# EAGLE design sw63_mk3_2 (EAGLE 9.6.2)
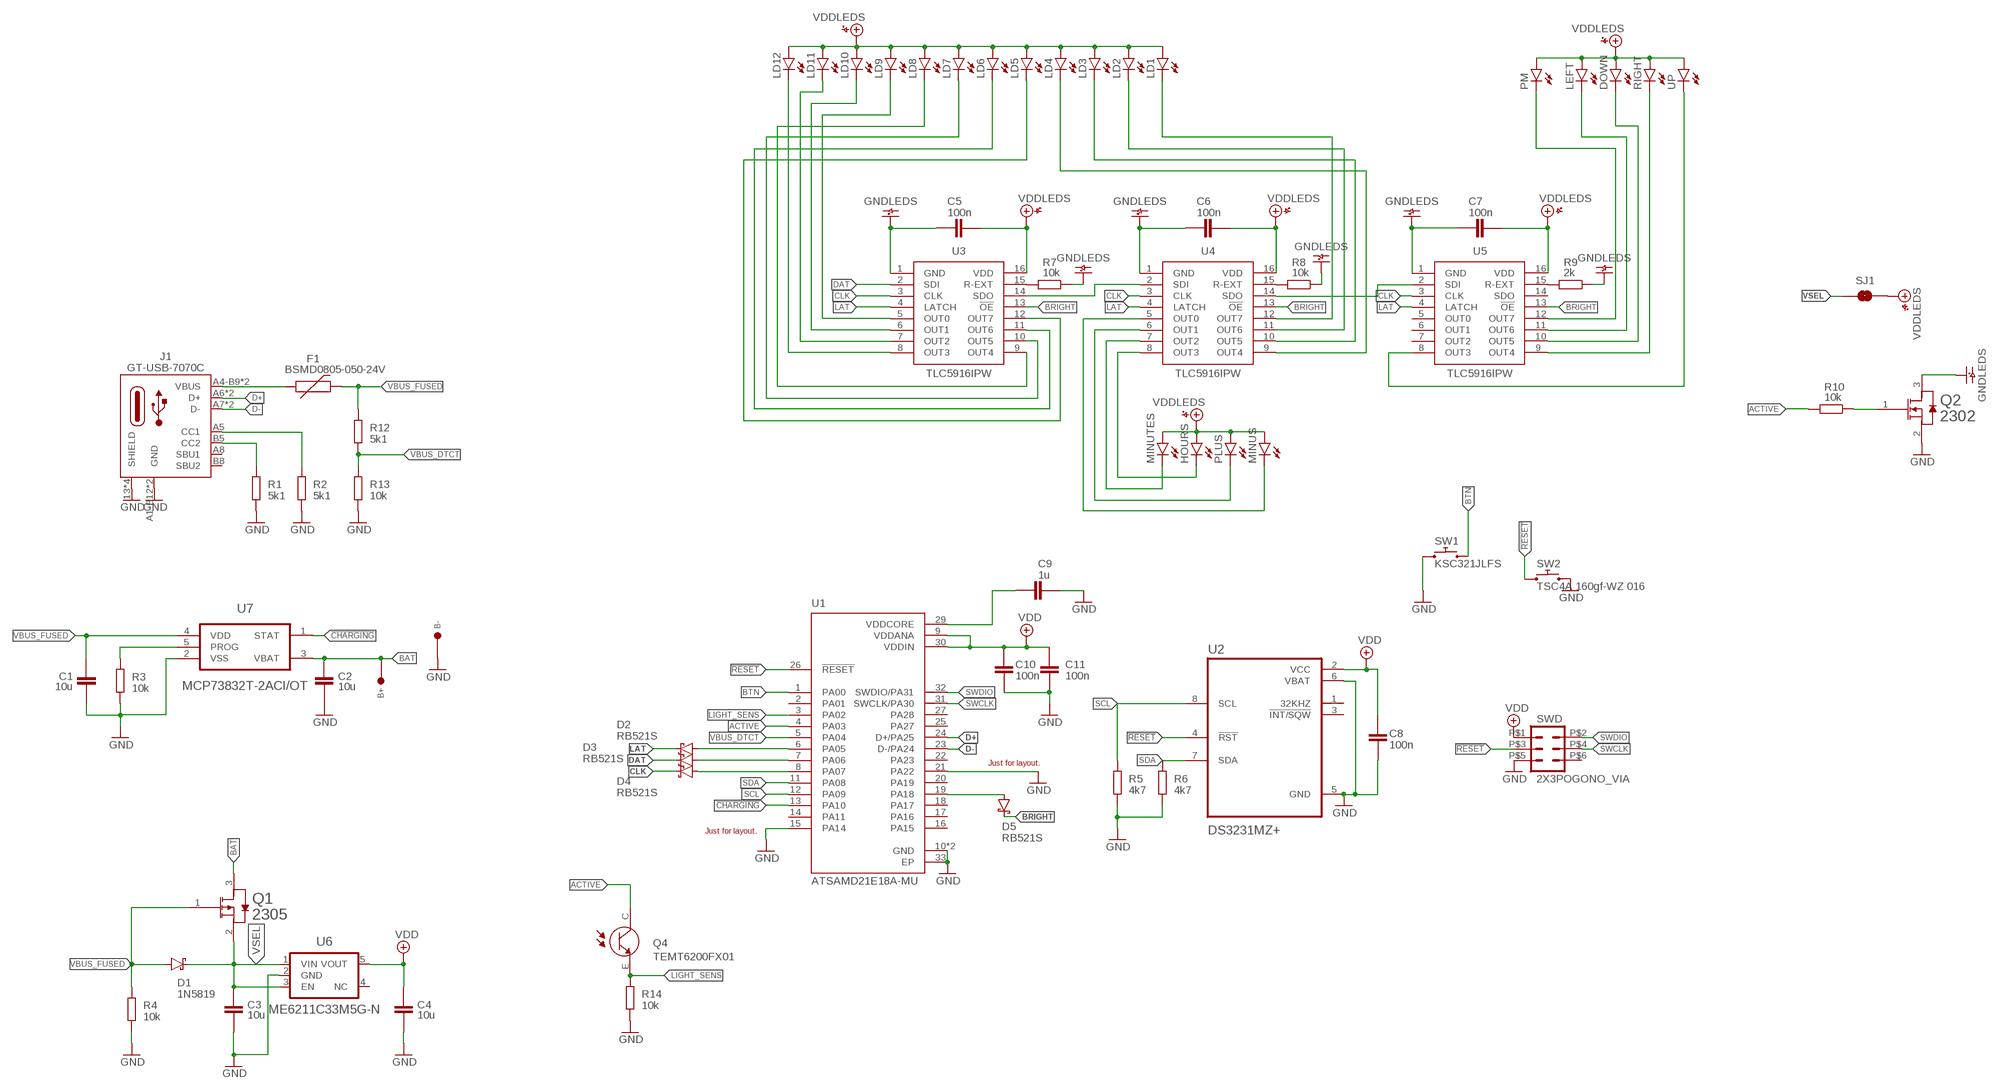
[diagram p0: schematic, sheet 1]

## Parts
B+  TEST_PIN_LARGE  [TEST_PIN_2.0]
B-  TEST_PIN_LARGE  [TEST_PIN_2.0]
C1  10u  CAPACITOR0805  [CAPACITOR0805]
C2  10u  CAPACITOR0805  [CAPACITOR0805]
C3  10u  CAPACITOR0805  [CAPACITOR0805]
C4  10u  CAPACITOR0805  [CAPACITOR0805]
C5  100n  CAPACITOR0603  [CAPACITOR0603]
C6  100n  CAPACITOR0603  [CAPACITOR0603]
C7  100n  CAPACITOR0603  [CAPACITOR0603]
C8  100n  CAPACITOR0603  [CAPACITOR0603]
C9  1u  CAPACITOR0603  [CAPACITOR0603]
C10  100n  CAPACITOR0603  [CAPACITOR0603]
C11  100n  CAPACITOR0603  [CAPACITOR0603]
D1  1N5819  SCHOTTKY_DIODE  [SOD123]
D2  RB521S  SCHOTTKY_DIODE_SOD523  [SOD523]
D3  RB521S  SCHOTTKY_DIODE_SOD523  [SOD523]
D4  RB521S  SCHOTTKY_DIODE_SOD523  [SOD523]
D5  RB521S  SCHOTTKY_DIODE_SOD523  [SOD523]
DOWN  LED_RECT-3.2X2  [LED_RECT_3.2X2]
F1  BSMD0805-050-24V  PTC  [PTC0805]
HOURS  LED_THT-5MM_B  [LED_5MM_BLUE]
J1  GT-USB-7070C  USB-C_2.0_SMT_WS  [USB-C_FULL_SMT_WS]
LD1  LED_SMT_1206  [LED_1206]
LD2  LED_SMT_1206  [LED_1206]
LD3  LED_SMT_1206  [LED_1206]
LD4  LED_SMT_1206  [LED_1206]
LD5  LED_SMT_1206  [LED_1206]
LD6  LED_SMT_1206  [LED_1206]
LD7  LED_SMT_1206  [LED_1206]
LD8  LED_SMT_1206  [LED_1206]
LD9  LED_SMT_1206  [LED_1206]
LD10  LED_SMT_1206  [LED_1206]
LD11  LED_SMT_1206  [LED_1206]
LD12  LED_SMT_1206  [LED_1206]
LEFT  LED_RECT-3.2X2  [LED_RECT_3.2X2]
MINUS  LED_THT-5MM_R  [LED_5MM_RED]
MINUTES  LED_THT-5MM_Y  [LED_5MM_YELLOW]
PLUS  LED_THT-5MM_G  [LED_5MM_GREEN]
PM  LED_THT-3MM_ALT  [LED_3MM_ALT]
Q1  2305  LGE2305  [SOT23]
Q2  2302  N-MOSFET  [SOT23]
Q4  TEMT6200FX01  [TEMT6200FX01]
R1  5k1  RESISTOR0603  [RESISTOR0603]
R2  5k1  RESISTOR0603  [RESISTOR0603]
R3  10k  RESISTOR0603  [RESISTOR0603]
R4  10k  RESISTOR0603  [RESISTOR0603]
R5  4k7  RESISTOR0603  [RESISTOR0603]
R6  4k7  RESISTOR0603  [RESISTOR0603]
R7  10k  RESISTOR0603  [RESISTOR0603]
R8  10k  RESISTOR0603  [RESISTOR0603]
R9  2k  RESISTOR0603  [RESISTOR0603]
R10  10k  RESISTOR0603  [RESISTOR0603]
R12  5k1  RESISTOR0603  [RESISTOR0603]
R13  10k  RESISTOR0603  [RESISTOR0603]
R14  10k  RESISTOR0603  [RESISTOR0603]
RIGHT  LED_RECT-3.2X2  [LED_RECT_3.2X2]
SJ1  SMALL_NC  [SMALL_NC_NOSILK]
SW1  KSC321JLFS  KSC3XXJ  [KSC3XXJ]
SW2  TSC4A 160gf-WZ 016  EVQ-P7J01P  [EVQ-P7J01P]
SWD  2X3POGONO_VIA  [2X3_POGO_NO_VIA]
U1  ATSAMD21E18A-MU  [QFN50P500X500X100-33N]
U2  DS3231MZ+  [SO8]
U3  TLC5916IPW  [TSSOP16]
U4  TLC5916IPW  [TSSOP16]
U5  TLC5916IPW  [TSSOP16]
U6  ME6211C33M5G-N  MIC5504YM5-TR  [SOT23-5]
U7  MCP73832T-2ACI/OT  MCP73831T-2ACI  [SOT23-5]
UP  LED_RECT-3.2X2  [LED_RECT_3.2X2]

## Nets
!CHARGING: U1.13(PA10) U7.1(STAT)
!RESET: SW2.1_1 SW2.1_2 SWD.P$3 U1.26(!RESET) U2.4(!RST)
ACTIVE: Q4.C R10.2 U1.4(PA03)
BAT: B+.P$1 C2.1 Q1.3(DRAIN) U7.3(VBAT)
BRIGHT: D5.C U3.13(!OE) U4.13(!OE) U5.13(!OE)
BTN: SW1.2 SW1.4 U1.1(PA00)
CLK: D4.C U3.3(CLK) U4.3(CLK) U5.3(CLK)
D+: J1.A6(D+) J1.B6(D+) U1.24(D+/PA25)
D-: J1.A7(D-) J1.B7(D-) U1.23(D-/PA24)
DAT: D3.C U3.2(SDI)
DBRIGHT: D5.A U1.19(PA18)
DCLK: D4.A U1.8(PA07)
DDAT: D3.A U1.7(PA06)
DLAT: D2.A U1.6(PA05)
GND: B-.P$1 C1.2 C2.2 C3.2 C4.2 C8.2 C9.1 C10.1 C11.1 J1.13(SHIELD) J1.14(SHIELD) J1.15(SHIELD) J1.16(SHIELD) J1.A1-B12(GND) J1.B1-A12(GND) Q2.2(SOURCE) R1.1 R2.1 R3.1 R4.1 R5.1 R6.1 R13.1 R14.1 SW1.1 SW1.3 SW2.2_1 SW2.2_2 SWD.P$5 U1.10(GND) U1.15(PA14) U1.21(PA22) U1.28(GND) U1.33(EP) U2.5(GND) U2.6(VBAT) U6.2(GND) U7.2(VSS)
GNDLEDS: C5.1 C6.1 C7.1 Q2.3(DRAIN) R7.1 R8.1 R9.1 U3.1(GND) U4.1(GND) U5.1(GND)
LAT: D2.C U3.4(LATCH) U4.4(LATCH) U5.4(LATCH)
LIGHT_SENS: Q4.E R14.2 U1.3(PA02)
N$1: F1.2 J1.A4-B9(VBUS) J1.B4-A9(VBUS)
N$2: J1.B5(CC2) R1.2
N$3: J1.A5(CC1) R2.2
N$4: R3.2 U7.5(PROG)
N$5: LD12.C U3.8(OUT3)
N$7: LD11.C U3.7(OUT2)
N$8: R7.2 U3.15(R-EXT)
N$9: R8.2 U4.15(R-EXT)
N$10: R9.2 U5.15(R-EXT)
N$11: Q2.1(GATE) R10.1
N$12: U4.14(SDO) U5.2(SDI)
N$13: U3.14(SDO) U4.2(SDI)
N$15: PM.K(C) U5.12(OUT7)
N$16: DOWN.K(C) U5.10(OUT5)
N$17: LEFT.K(C) U5.11(OUT6)
N$18: RIGHT.K(C) U5.9(OUT4)
N$19: U5.8(OUT3) UP.K(C)
N$20: LD10.C U3.6(OUT1)
N$21: LD9.C U3.5(OUT0)
N$22: LD8.C U3.9(OUT4)
N$23: LD7.C U3.10(OUT5)
N$24: LD6.C U3.11(OUT6)
N$25: LD5.C U3.12(OUT7)
N$26: C9.2 U1.29(VDDCORE)
N$27: LD4.C U4.9(OUT4)
N$28: LD3.C U4.10(OUT5)
N$29: LD2.C U4.11(OUT6)
N$30: LD1.C U4.12(OUT7)
N$31: HOURS.K(C) U4.8(OUT3)
N$32: MINUTES.K(C) U4.7(OUT2)
N$33: PLUS.K(C) U4.6(OUT1)
N$34: MINUS.K(C) U4.5(OUT0)
SCL: R5.2 U1.12(PA09) U2.8(SCL)
SDA: R6.2 U1.11(PA08) U2.7(SDA)
SWCLK: SWD.P$4 U1.31(SWCLK/PA30)
SWDIO: SWD.P$2 U1.32(SWDIO/PA31)
VBUS_DTCT: R12.1 R13.2 U1.5(PA04)
VBUS_FUSED: C1.1 D1.A F1.3 Q1.1(GATE) R4.2 R12.2 U7.4(VDD)
VDD: C4.1 C8.1 C10.2 C11.2 SWD.P$1 U1.9(VDDANA) U1.30(VDDIN) U2.2(VCC) U6.5(VOUT)
VDDLEDS: C5.2 C6.2 C7.2 DOWN.A HOURS.A LD1.A LD2.A LD3.A LD4.A LD5.A LD6.A LD7.A LD8.A LD9.A LD10.A LD11.A LD12.A LEFT.A MINUS.A MINUTES.A PLUS.A PM.A RIGHT.A SJ1.2 U3.16(VDD) U4.16(VDD) U5.16(VDD) UP.A
VSEL: C3.1 D1.C Q1.2(SOURCE) SJ1.1 U6.1(VIN) U6.3(EN)
Unconnected: J1.A8(SBU1) J1.B8(SBU2) SWD.P$6 U1.2(PA01) U1.14(PA11) U1.16(PA15) U1.17(PA16) U1.18(PA17) U1.20(PA19) U1.22(PA23) U1.25(PA27) U1.27(PA28) U2.1(32KHZ) U2.3(!INT/SQW) U5.5(OUT0) U5.6(OUT1) U5.7(OUT2) U5.14(SDO) U6.4(NC)

## Notes on the sheet
- Just for layout.
- Just for layout.

## Library data of the parts
B+ B- = BASTL_PINHEADERS:TEST_PIN
C1-C4 = BASTL_CAPACITORS:CAPACITOR0805; ODOO: 0.1; SIZEX: 1.2; SIZEY: 2; SIZEZ: 1.2; TYPE: SMT
C5-C11 = BASTL_CAPACITORS:CAPACITOR0603; ODOO: 0.1; SIZEX: 0.85; SIZEY: 1.55; SIZEZ: 0.8; TYPE: SMT
D1-D5 = BASTL_DIODES:SCHOTTKY_DIODE: Various Shottky Diodes
DOWN LEFT RIGHT UP = BASTL_LEDS:LED_RECT
F1 = BASTL_FUSES:PTC; SIZEX: 1.2; SIZEY: 2; SIZEZ: 0.5; TYPE: SMT
HOURS MINUS MINUTES PLUS PM = BASTL_LEDS:LED_THT: [color]_[diameter]_[difused/clear] R_3mm_D
J1 = BASTL_CONNECTORS:USB-C_2.0_SMT_WS: Weather sealed fully SMT USB-C GT-USB-7070C
LD1-LD12 = BASTL_LEDS:LED_SMT
Q1 = BASTL_TRANZISTORS:LGE2305
Q2 = BASTL_TRANZISTORS:N-MOSFET
Q4 = BASTL_TRANZISTORS:TEMT6200FX01: Phototransistors 550nm Top View 0805 (2012 Metric) Check availability <https://pricing.snapeda.com/parts/TEMT6200FX01/Vishay%20Semiconductor/view-part?ref=eda>; AVAILABILITY: In Stock; CHECK_PRICES: https://www.snapeda.com/parts/TEMT6200FX01/Vishay+Semiconductor+Opto+Division/view-part/?ref=eda; DESCRIPTION: Phototransistors 550nm Top View 0805 (2012 Metric); MF: Vishay Semiconductor; MP: TEMT6200FX01; PACKAGE: 0805 Vishay; PRICE: None; PURCHASE-URL: https://www.snapeda.com/api/url_track_click_mouser/?unipart_id=43955&manufacturer=Vishay Semiconductor&part_name=TEMT6200FX01&search_term=temt6200fx01; SNAPEDA_LINK: https://www.snapeda.com/parts/TEMT6200FX01/Vishay+Semiconductor+Opto+Division/view-part/?ref=snap
R1-R10 R12-R14 = BASTL_RESISTORS:RESISTOR0603; ASSEMBLED: yes; PRICE: 0.1; SIZEX: 0.85; SIZEY: 1.55; SIZEZ: 0.5; TYPE: SMT
SJ1 = BASTL_JUMPERS:SMALL_NC
SW1 = BASTL_SWITCHES:KSC3XXJ
SW2 = BASTL_SWITCHES:EVQ-P7J01P: PANASONIC EVQ-P7J01P ALPSALPINE SKSCLAE010 SHOU HAN TSC4A 160gf-WZ 016 (C2906284)
SWD = BASTL_CONNECTORS:2X3POGO; TYPE: POGO
U1 = BASTL_ICS:ATSAMD21E18A-MU: SAMD21E Series 256 KB Flash 32 KB SRAM 48 MHz 32-Bit Microcontroller - QFN-32; CHECK_PRICES: https://www.snapeda.com/parts/ATSAMD21E18A-MU/Microchip/view-part/?ref=eda; DESCRIPTION: ARM® Cortex®-M0+ SAM D21E, Functional Safety (FuSa) Microcontroller IC 32-Bit Single-Core 48MHz 256KB (256K x 8) FLASH 32-VQFN (5x5); DIGIKEY_PART_NUMBER: ATSAMD21E18A-MU-ND; MF: Microchip; MP: ATSAMD21E18A-MU; PACKAGE: QFN-32 Microchip; PURCHASE-URL: https://www.snapeda.com/api/url_track_click_mouser/?unipart_id=227694&manufacturer=Microchip&part_name=ATSAMD21E18A-MU&search_term=None; SNAPEDA_LINK: https://www.snapeda.com/parts/ATSAMD21E18A-MU/Microchip/view-part/?ref=snap
U2 = BASTL_ICS:DS3231MZ+; DESCRIPTION: Real Time Clock (RTC) IC Clock/Calendar I²C, 2-Wire Serial 8-SOIC (0.154, 3.90mm Width); DIGI-KEY_PART_NUMBER: DS3231MZ+-ND; MF: Maxim Integrated Products; MP: DS3231MZ+; PACKAGE: None
U3-U5 = BASTL_ICS:TLC5916: LED driver, all variants should be compatible. TSSOP16 package: TLC5916IPW STP08CP05TTR SCT2167CSSG
U6 = BASTL_ICS:MIC5504YM5-TR: 3.3V: MIC5504-3.3YM5-TR
U7 = BASTL_ICS:MCP73831T-2ACI: Charge Management Controller; MPN: MCP73831T-2ACI/OT; OC_FARNELL: 1332158; OC_NEWARK: 56K7045; PACKAGE: SOT-5; SUPPLIER: Microchip

## Board
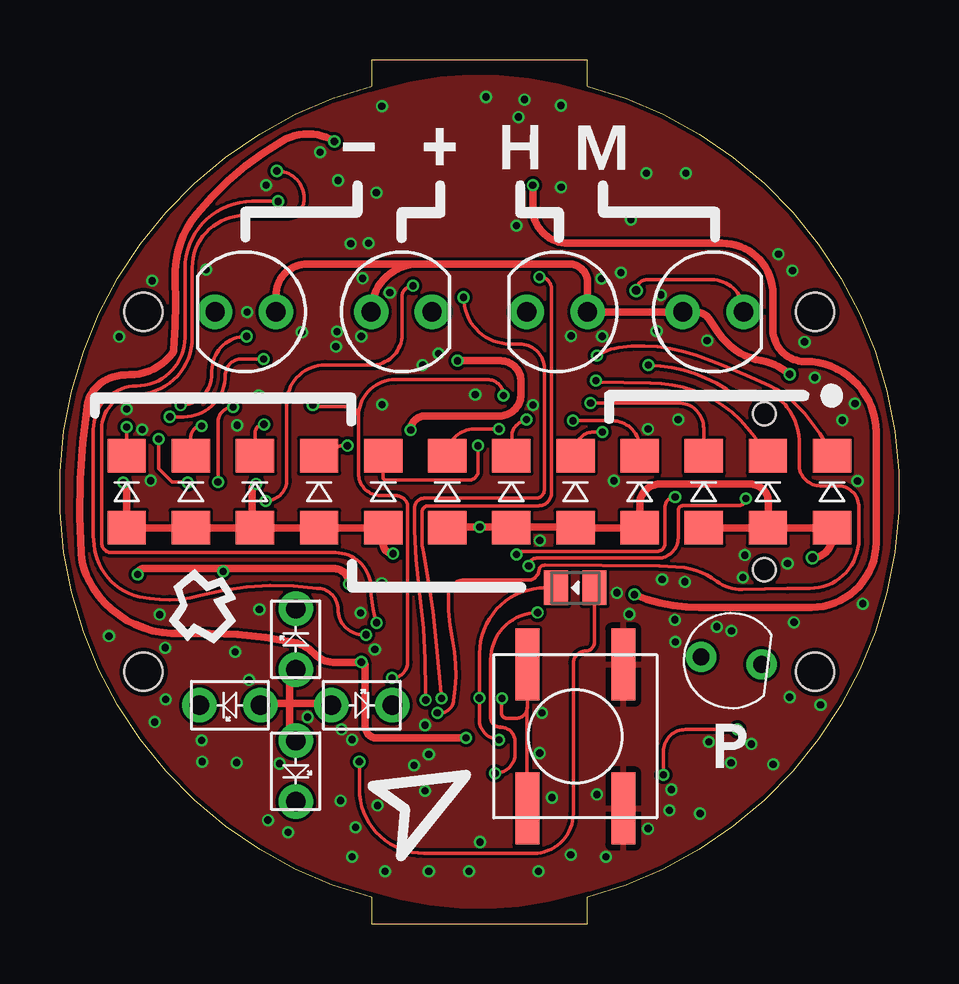
[diagram p1: board, top side]
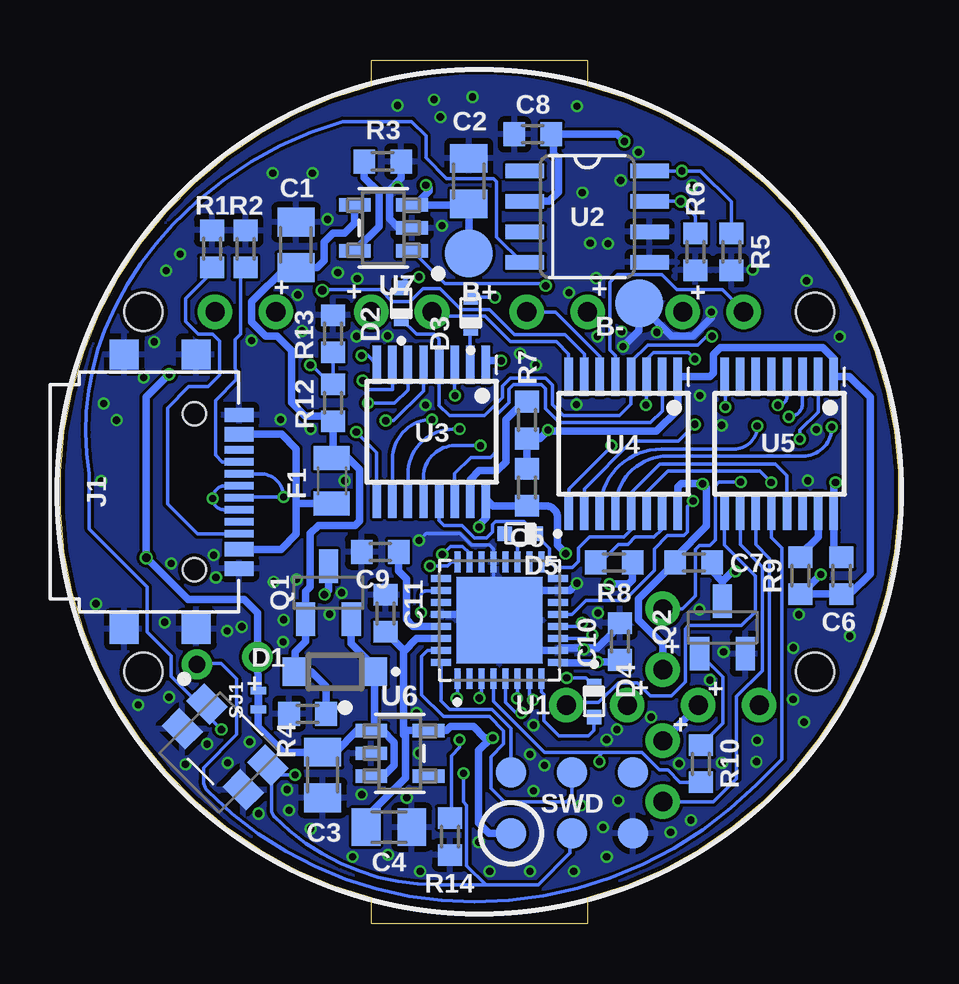
[diagram p2: board, bottom side, seen from below]

Size 34.97 x 36 mm. Coordinates in mm from the lower left corner, seen from the top.
Outline: 21.98,34.92 21.98,36 12.98,36 12.98,34.92 arc150 12.98,1.08 12.98,0 21.98,0 21.98,1.08 arc150 21.98,34.92
Copper layers (1*16): Top 0.035mm / dielectric 1.6mm / Bottom 0.035mm
Design rules "jlcpcb-2layers *": minimum track width 5mil, minimum drill 0.3mm, track to track 5mil, track to pad 5mil, pad to pad 5mil, via to via 5mil, smd to smd 5mil, copper to edge 0.2mm, drill to drill 6mil, minimum pad ring 10mil, minimum via ring 4mil, stop-mask expansion 4mil, vias tented up to drill 15mil, thermal gap 10mil
Holes 1.6 mm at 3.48,10.5 3.48,25.5 31.48,10.5 31.48,25.5
tRestrict: area 12.1,34.7 to 23.1,36.3; area 11.9,-0.3 to 22.9,1.3
bRestrict: area 12.1,34.7 to 23.1,36.3; area 11.9,-0.3 to 22.9,1.3

### Footprints (pad centres in the part's own frame; a part is rotated, then mirrored left to right if it is on the bottom)
TEST_PIN_2.0 = smd 2 x 2: P$1 0,0
CAPACITOR0805 = smd 1.2 x 1.55: 1 -0.95,0; 2 0.95,0
CAPACITOR0603 = smd 0.9 x 1: 1 -0.771,0; 2 0.771,0
SOD123 = smd 1.05 x 1.2: A 1.654,0; C -1.654,0
SOD523 = smd 0.6 x 0.6: A 0.65,0; C -0.65,0
LED_RECT_3.2X2 = drill 0.8 pad 1.2: A -1.27,0; K 1.27,0
PTC0805 = smd 1 x 1.5: 2 0.921,0; 3 -0.972,0
LED_5MM_BLUE = drill 0.8: A -1.27,0; K 1.27,0
USB-C_FULL_SMT_WS = smd 1.25 x 1.2: 13 -5.72,0; 14 5.72,0; 15 -5.72,3; 16 5.72,3 | smd 0.6 x 1.2: A1-B12 -3.2,4.79; A4-B9 -2.4,4.79; B1-A12 3.2,4.79; B4-A9 2.4,4.79 | smd 0.3 x 1.2: A5 -1.25,4.79; A6 -0.25,4.79; A7 0.25,4.79; A8 1.25,4.79; B5 1.75,4.79; B6 0.75,4.79; B7 -0.75,4.79; B8 -1.75,4.79 | hole 0.95: 3.25,2.92; -3.25,2.92
LED_1206 = smd 1.4 x 1.6: A -1.5,0; C 1.5,0
LED_5MM_RED = drill 0.8: A -1.27,0; K 1.27,0
LED_5MM_YELLOW = drill 0.8: A -1.27,0; K 1.27,0
LED_5MM_GREEN = drill 0.8: A -1.27,0; K 1.27,0
LED_3MM_ALT = drill 0.7 pad 1.143: A -1.27,0; K 1.27,0
SOT23 = smd 0.8 x 1.4: 1 -0.95,-1.1; 2 0.95,-1.1; 3 0,1.1
TEMT6200FX01 = smd 1 x 1.45: C 0.8,0; E -0.8,0
RESISTOR0603 = smd 0.9 x 1: 1 -0.771,0; 2 0.771,0
SMALL_NC_NOSILK = smd 0.33 x 0.635: 1 -0.394,0; 2 0.394,0
KSC3XXJ = smd 3 x 1: 1 -3,2; 2 -3,-2; 3 3,2; 4 3,-2
EVQ-P7J01P = smd 1.4 x 1.05: 1_1 -1.8,0.725; 1_2 1.8,0.725; 2_1 -1.8,-0.725; 2_2 1.8,-0.725
2X3_POGO_NO_VIA = smd 1.27 x 1.27: P$1 0,0; P$2 0,2.54; P$3 2.54,0; P$4 2.54,2.54; P$5 5.08,0; P$6 5.08,2.54
QFN50P500X500X100-33N = smd 0.84 x 0.26: 1 -2.435,1.75; 2 -2.435,1.25; 3 -2.435,0.75; 4 -2.435,0.25; 5 -2.435,-0.25; 6 -2.435,-0.75; 7 -2.435,-1.25; 8 -2.435,-1.75; 17 2.435,-1.75; 18 2.435,-1.25; 19 2.435,-0.75; 20 2.435,-0.25; 21 2.435,0.25; 22 2.435,0.75; 23 2.435,1.25; 24 2.435,1.75 | smd 0.26 x 0.84: 9 -1.75,-2.435; 10 -1.25,-2.435; 11 -0.75,-2.435; 12 -0.25,-2.435; 13 0.25,-2.435; 14 0.75,-2.435; 15 1.25,-2.435; 16 1.75,-2.435; 25 1.75,2.435; 26 1.25,2.435; 27 0.75,2.435; 28 0.25,2.435; 29 -0.25,2.435; 30 -0.75,2.435; 31 -1.25,2.435; 32 -1.75,2.435 | smd 3.6 x 3.6: 33 0,0
SO8 = smd 1.6 x 0.6: 1 -2.6,1.905; 2 -2.6,0.635; 3 -2.6,-0.635; 4 -2.6,-1.905; 5 2.6,-1.905; 6 2.6,-0.635; 7 2.6,0.635; 8 2.6,1.905
TSSOP16 = smd 1.6 x 0.35: 1 -2.8,2.275; 2 -2.8,1.625; 3 -2.8,0.975; 4 -2.8,0.325; 5 -2.8,-0.325; 6 -2.8,-0.975; 7 -2.8,-1.625; 8 -2.8,-2.275; 9 2.8,-2.275; 10 2.8,-1.625; 11 2.8,-0.975; 12 2.8,-0.325; 13 2.8,0.325; 14 2.8,0.975; 15 2.8,1.625; 16 2.8,2.275
SOT23-5 = smd 1.321 x 0.559: 1 -1.194,0.95; 2 -1.194,0; 3 -1.194,-0.95; 4 1.194,-0.95; 5 1.194,0.95

### Placement (x,y rotation side)
B+  17.93,27.93 0 bottom
B-  10.83,25.85 0 bottom
C1  25.12,28.29 90 bottom
C2  17.92,30.95 90 bottom
C3  24.02,6.2 270 bottom
C4  21.25,4.02 0 bottom
C5  15.49,18.18 270 bottom
C6  2.38,14.5 90 bottom
C7  8.54,15.05 180 bottom
C8  15.25,32.9 180 bottom
C9  21.61,15.49 0 bottom
C10  11.63,11.76 270 bottom
C11  21.4,12.93 270 bottom
D1  23.5,10.5 180 bottom
D2  20.74,25.85 90 bottom
D3  17.84,25.46 90 bottom
D4  12.7,9.26 270 bottom
D5  15.77,16.25 180 bottom
DOWN  9.83,6.35 270 top
F1  500mA  [PTC0805]  23.63,18.43 270 bottom
HOURS  20.72,25.5 180 top
J1  USB-C_2.0_SMT_WS  [USB-C_FULL_SMT_WS]  32.28,18 270 bottom
LD1  2.78,18 90 top
LD2  5.46,18 90 top
LD3  8.13,18 90 top
LD4  10.8,18 90 top
LD5  13.47,18 90 top
LD6  16.15,18 90 top
LD7  18.82,18 90 top
LD8  21.49,18 90 top
LD9  24.16,18 90 top
LD10  26.84,18 90 top
LD11  29.51,18 90 top
LD12  32.18,18 90 top
LEFT  7.08,9.1 180 top
MINUS  7.73,25.5 180 top
MINUTES  27.23,25.5 0 top
PLUS  14.24,25.5 0 top
PM  27.99,10.96 353 top
Q1  LGE2305  [SOT23]  23.77,13.79 0 bottom
Q2  N-MOSFET  [SOT23]  7.35,12.35 0 bottom
Q4  21.48,14 0 top
R1  28.63,28.13 270 bottom
R2  27.23,28.12 270 bottom
R3  21.51,31.77 180 bottom
R4  24.64,8.75 0 bottom
R5  6.98,28 90 bottom
R6  8.48,28 90 bottom
R7  15.5,20.99 90 bottom
R8  11.87,15.06 180 bottom
R9  4.09,14.5 90 bottom
R10  8.24,6.66 270 bottom
R12  23.57,21.71 270 bottom
R13  23.58,24.59 270 bottom
R14  18.71,3.63 90 bottom
RIGHT  12.58,9.1 0 top
SJ1  26.7,9.31 90 bottom
SW1  21.48,7.8 270 top
SW2  EVQ-P7J01P  [EVQ-P7J01P]  28.08,7.36 315 bottom
SWD  16.16,3.76 0 bottom
U1  16.64,12.64 90 bottom
U2  12.98,29.47 0 bottom
U3  19.48,20.5 270 bottom
U4  11.48,20 270 bottom
U5  4.98,20 270 bottom
U6  MIC5504YM5-TR  [SOT23-5]  20.8,7.09 0 bottom
U7  21.48,29 180 bottom
UP  9.83,11.85 90 top

### Tracks (layer width: path | path; a pad name or v marks a point on that pad's centre or on a via)
!CHARGING  (via drill 0.3)
  Top 0.152: v8.57,17.62 arc90 9.46,18.5 9.46,21.68 arc-90 11.06,23.28 12.99,23.28 arc90 14.26,24.55 14.26,26.13 arc-90 v14.71,26.59
  Bottom 0.152: U1.13 13.61,12.89 13.03,13.47 11.43,13.47 10.18,14.72 10.18,15.62 9.63,16.17 8.96,16.17 8.8,16.33 8.8,17.39 v8.57,17.62 | U7.1 18.92,26.68 14.81,26.68 v14.71,26.59
!RESET  (via drill 0.3)
  Top 0.152: v28.24,8.09 26.07,8.09 arc90 25.16,7.18 v25.16,6.2 | v18.14,6.26 arc90 18.97,7.09 18.97,7.58 arc90 18.36,8.19 18.36,8.18 arc-90 17.95,8.59 17.95,11 arc-90 v19.91,12.96
  Bottom 0.152: v25.16,6.2 v25.16,6.21 25.9,6.21 SW2.1_2 26.28,6.22 arc45 26.13,5.86 arc45 26.15,5.84 26.15,4.78 arc-45 26,4.42 arc-45 19.21,1.61 17.2,1.61 | v28.24,8.09 28.94,8.79 28.94,9.05 SW2.1_1 29.18,9.15 30.34,10.3 30.34,11.15 31.33,12.15 31.33,14.04 33.74,16.45 33.74,18.74 arc31 33.09,24.74 arc22 30.26,29.14 arc30 23.18,33.43 20.3,33.43 19.71,32.84 19.71,31.92 18.84,31.05 16.88,31.05 16.76,30.93 16.76,28.62 15.7,27.57 U2.4 | v19.91,12.96 19.91,13.67 arc90 19.72,13.86 19.11,13.86 arc-90 U1.26 | SWD.P$3 13.7,3.68 13.7,2.94 15.03,1.61 17.2,1.61 | 17.2,1.61 18.01,2.42 18.01,4.93 18.14,5.07 v18.14,6.26
ACTIVE  (via drill 0.3)
  Top 0.152: Q4.C 22.28,11.73 arc-90 21.91,11.36 arc90 21.4,10.85 21.4,4.59 arc-90 19.74,2.93 15.17,2.93 arc-90 12.48,5.62 v12.48,6.75
  Bottom 0.152: R10.2 9.12,5.89 9.63,6.4 9.97,6.4 10.71,7.13 12.34,7.13 | U1.4 16.89,9.26 14.77,7.13 12.34,7.13 | v12.48,6.75 12.48,7 12.34,7.13
BAT  (via drill 0.3)
  Top 0.305: v19.71,30.78 19.71,29.84 arc90 21.19,28.36 27.6,28.36 arc-90 29.72,26.24 29.72,24.76 arc90 31.05,23.43 31.07,23.43 arc-90 34.02,20.48 34.02,15.88 arc-90 31.32,13.18 26.67,13.18 arc-22 v23.94,13.71
  Bottom 0.305: Q1.3 23.77,13.88 arc-90 v23.94,13.71 | v19.71,30.78 arc-90 19.66,30.78 19.58,30.7 19.58,30.52 20.16,29.95 U7.3 17.97,29.95 C2.1 B+.P$1 arc90 B+.P$1
BRIGHT
  Bottom 0.152: U3.13 19.16,16.81 18.95,16.6 18.21,16.6 17.68,16.07 17.19,16.07 16.93,16.33 16.93,16.64 16.82,16.76 15.63,16.76 D5.C 15.12,16.2 14.55,15.63 14.55,15.09 14.31,14.85 13.59,14.85 13.35,15.09 13.35,15.65 12.89,16.11 11.45,16.11 11.16,16.41 U4.13 11.16,17.95 9.95,19.16 5.14,19.16 4.66,18.68 U5.13
BTN  (via drill 0.3)
  Top 0.152: SW1.4 19.47,4.81 19.47,8.99 | SW1.2 19.48,9 19.47,8.99 | 19.47,8.99 arc-90 19.04,8.56 18.61,8.56 arc-90 18.41,8.76 v18.41,9.38 v18.42,9.39
  Bottom 0.152: U1.1 18.39,9.42 v18.42,9.39
CLK  (via drill 0.3)
  Top 0.152: v10.54,21.61 arc90 10.6,21.55 12.03,21.55 arc-90 12.44,21.14 | 12.44,21.14 12.44,18.77 arc90 13.37,17.84 14,17.84 arc-90 14.5,17.34 arc90 14.49,17.34 14.49,10.89 arc-90 v13.84,10.24 | v4.58,21.12 5.16,21.12 arc90 6.89,22.85 arc-90 7.58,23.54 v8.49,23.54 | v18.49,22.01 arc90 17.83,22.67 13.98,22.67 arc90 12.44,21.14
  Bottom 0.152: U3.3 18.51,22.02 v18.49,22.01 | v10.54,21.61 arc-90 10.51,21.64 U4.3 10.51,23.52 10.22,23.8 8.76,23.8 v8.49,23.54 | U5.3 4.01,21.7 arc90 v4.58,21.12 | D4.C 13.04,10.24 v13.84,10.24
D+  (via drill 0.3)
  Top 0.152: v19.54,14.91 arc-90 19.86,15.23 24.93,15.23 arc90 25.77,16.07 25.77,17.2 arc-90 26,17.43 28.31,17.43 arc90 v28.59,17.72
  Bottom 0.152: U1.24 18.64,15.07 18.81,14.91 v19.54,14.91 | J1.B6 28.13,17.25 arc90 v28.59,17.72 arc90 28.06,18.25 J1.A6
D-  (via drill 0.3)
  Top 0.152: v25.64,17.79 v25.64,17.78 arc90 25.22,17.36 25.22,15.86 arc-90 24.87,15.51 19.15,15.51 v19.03,15.39
  Bottom 0.152: U1.23 17.89,15.44 18.18,15.72 18.69,15.72 v19.03,15.39 | J1.A7 27.45,17.79 v25.65,17.79 v25.64,17.79 arc-90 26.61,18.75 J1.B7
DAT
  Bottom 0.152: U3.2 17.88,23.32 17.88,24.77 D3.C
DBRIGHT
  Bottom 0.152: U1.19 15.89,15.72 D5.A
DCLK
  Bottom 0.152: D4.A 12.7,8.05 12.94,7.82 14.16,7.82 14.79,8.45 14.79,9.55 14.89,9.65 U1.8
DDAT  (via drill 0.3)
  Top 0.152: v15.25,9.31 15.25,9.71 arc8 15.01,13.59 arc-5 14.8,15.96 arc-5 14.78,17.35 arc-93 15.21,17.73 19.84,17.73 arc90 20.19,18.08 20.19,23.13 arc90 19.17,24.16 18.78,24.16 arc-90 v16.83,26.11
  Bottom 0.152: U1.7 15.39,9.46 v15.25,9.31 | v16.83,26.11 arc-90 v16.83,26.11 D3.A
DLAT  (via drill 0.3)
  Top 0.152: v19.99,26.96 arc-90 20.49,26.46 20.49,17.96 arc-90 19.95,17.42 15.37,17.42 arc90 15.09,17.13 15.09,16.05 arc16 15.16,15.46 arc-5 15.68,11.78 v15.91,9.39
  Bottom 0.152: U1.6 15.9,9.56 arc6 v15.91,9.39 | v19.99,26.96 20.29,26.96 arc-90 D2.A
GND  (via drill 0.3)
  Bottom 0.152: 16.89,12.89 U1.21 16.89,15.61 17.06,15.78 17.81,15.78 18.3,16.27 19.71,16.27 v20,15.97
  Bottom 0.305: U1.28 16.89,12.89 U1.33 | U1.33 15.39,11.39 U1.10 14.12,11.48 12.57,11.48 11.63,12.42 C10.1 | v7.81,25.49 7.81,25.27 8.58,24.49 9.47,24.49 B-.P$1 10.83,24.73 v11.5,24.05 | U7.2 20.85,29 21.23,29.38 21.23,30.58 20.74,31.07 R3.1 | v13.42,14.19 13.71,13.89 U1.15 15.39,13.89 U1.33
  other vias: 8.29,22.01 7.38,20.77 3.78,18.46 2.78,21.45 2.46,24.46 15.78,23.77 15.12,23.28 21.31,24.5 25.05,26.2 24.87,24.71 31.04,24.25 30.54,27.22 24.44,31.28 26.09,31.28 20.89,34.1 17.76,34.46 13.42,34.08 13.19,30.47 12.86,28.36 13.75,26.31 11.59,30.98 10.85,32.16 8.59,30.78 3.84,26.79 6.09,27.26 12.54,12.95 20.1,8.78 20,7.1 20.51,5.25 11.69,5.12 7.36,6.71 7.3,11.32 3.95,8.4 5.9,7.64 4.39,11.5 2.04,11.98 8.31,13.1 23.73,12.9 23.22,13.79 25.66,11.73 31.71,9.11 29.73,6.64 28.83,7.48 30.42,9.44 27.98,6.69 27.06,7.58 26.68,4.58 25.49,5.58 25.41,4.72 24.52,3.95 21.29,2.86 22.77,2.79 9.51,3.8 11.74,8.09 7.88,10.15 13.12,11.42 26.98,24.31 20.89,30.7 19.37,34.35 19.03,29.09 10.08,24.65 11.55,24.67 12.12,28.34 12.61,26.9 12.56,24.48 17.31,22.05 3.43,20.59 13.43,21.63 19.72,21.61 23.1,18.46 9.16,6.67 10.32,8.6 25.1,14.34 24.52,20.62 22.6,24.48 23.38,27.14 22.57,26.88 19.11,33.62 23.81,29.35 29.95,27.91 15.38,2.18 13.55,2.18 12.17,2.79 13.24,4.92 15.22,5.53 14.77,6.6 15.22,8.27 12.17,7.66 8.67,4.31 5.93,6.75 22.39,5.38 15.38,7.05 17.05,2.18 19.95,2.18 4.4,9.34 12.33,4.01 17.51,3.4 4.16,12.88 32.61,20.98 31.47,22.77 33.14,21.68 30.33,15.02 33.25,18.45 28.47,14.43 33.47,13.33 30.6,12.56 28,12.2 26.05,14.25 25.77,21.02 28.56,15.36 25.64,12.66 27.39,12.37
  pour Bottom: -0.02,0.5 -0.02,35.5 34.98,35.5 34.98,0.5
  pour Top: -0.02,0.5 -0.02,35.5 34.98,35.5 34.98,0.5
GNDLEDS  (via drill 0.3)
  Top 0.305: v16.57,23.46 18.36,23.46 arc-90 19.22,22.6 19.22,22.07 arc-90 18.31,21.16 15.21,21.16 arc90 v14.62,20.57 | v12.05,14.15 arc90 11.4,14.8 6.93,14.8 | v6.81,14.68 6.93,14.8 | 6.93,14.8 3.49,14.8 arc90 v3.24,14.55
  Bottom 0.305: R8.1 11.1,14.33 11.28,14.15 v12.05,14.15 | v3.24,14.55 4.06,13.73 R9.1 C6.1 2.04,13.73 1.19,14.58 1.19,21.94 2.05,22.8 U5.1 2.71,23.56 3.15,24.01 7.44,24.01 7.73,23.72 7.73,22.94 7.87,22.8 U4.1 9.21,21.41 10.09,20.53 14.58,20.53 v14.62,20.57 14.62,20.56 14.96,20.22 R7.1 15.49,20.21 C5.1 | U3.1 arc90 17.05,23.46 v16.57,23.46 | C7.1 7.77,14.69 7.35,14.26 | Q2.3 7.35,14.26 | 7.35,14.26 6.93,14.68 v6.81,14.68
LAT  (via drill 0.3)
  Top 0.152: v5.04,21.61 arc90 6.33,22.9 6.33,23.05 arc-90 7.75,24.48 v7.78,24.48
  Bottom 0.152: v7.78,24.48 8.01,24.48 8.36,24.12 10.46,24.12 11.16,23.43 U4.4 11.16,21.66 11.65,21.17 13.98,21.17 14.44,21.63 14.44,22.45 14.73,22.74 16.19,22.74 16.52,22.41 16.52,21.92 17.27,21.17 18.73,21.17 19.16,21.59 U3.4 19.16,24.36 19.36,24.57 20.1,24.57 D2.C | U5.4 4.66,21.99 arc90 v5.04,21.61
LIGHT_SENS  (via drill 0.3)
  Top 0.152: Q4.E 20.23,14 arc90 17.49,11.26 v17.49,9.41 v17.48,9.4 17.48,8.5 arc90 18.31,7.68 v18.31,7.66
  Bottom 0.152: U1.3 17.39,9.65 17.48,9.56 v17.48,9.4 | R14.2 18.65,4.46 18.65,6.99 18.31,7.34 v18.31,7.66
N$1
  Bottom 0.305: J1.B4-A9 25.74,15.6 25.11,16.23 25.11,17.45 | J1.A4-B9 25.72,20.4 25.11,19.79 25.11,17.45 | F1.2 25.05,17.51 25.11,17.45
N$2
  Bottom 0.152: J1.B5 29.23,16.25 30.48,17.5 30.48,21.5 29.6,22.38 28.78,22.38 28.31,22.86 28.31,24.28 28.61,24.58 29.21,24.58 29.72,25.1 29.72,26.05 28.63,27.15 R1.2
N$3
  Bottom 0.152: R2.2 27.44,27.15 27.44,24.58 27.67,24.35 27.67,23.13 27.61,23.07 27.61,22.67 28.48,21.8 28.48,19.53 28.2,19.25 J1.A5
N$4
  Bottom 0.305: U7.5 21.67,29.05 21.67,30.48 22.28,31.09 R3.2
N$5  (via drill 0.3)
  Top 0.152: LD12.C arc21 30.68,21.64 arc19 29.61,22.4 arc6 26.51,23.69 arc28 23.27,24.01 arc24 v22.39,23.68
  Bottom 0.152: U3.8 22.15,23.69 v22.38,23.69 v22.39,23.68
N$7  (via drill 0.3)
  Top 0.152: v22.34,22.63 22.4,22.57 24.61,22.53 arc-55 28.95,20.3 LD11.C
  Bottom 0.152: U3.7 21.11,22.27 22.07,22.27 22.39,22.59 v22.34,22.63
N$8
  Bottom 0.305: U3.15 17.86,18.52 17.49,18.88 16.74,18.88 16.37,19.25 16.37,21.01 15.62,21.76 R7.2
N$9
  Bottom 0.152: R8.2 12.43,15.06 11.68,15.8 11.3,15.8 10.99,16.11 10.2,16.11 9.88,16.44 9.88,17.18 U4.15
N$10
  Bottom 0.305: R9.2 4.09,15.39 3.36,16.12 U5.15
N$11
  Bottom 0.152: R10.1 7.33,8.34 7.33,10.28 Q2.1
N$12  (via drill 0.3)
  Top 0.152: v4.12,20.2 4.12,18.98 4.68,18.41 5.29,18.41 v5.32,18.38
  Bottom 0.152: U4.14 10.51,17.98 9.62,18.86 5.8,18.86 v5.32,18.38 | U5.2 3.36,21.33 4.12,20.57 v4.12,20.2
N$13
  Bottom 0.152: U3.14 18.51,18.75 17.83,19.43 17.02,19.43 16.74,19.71 16.74,21.22 16.24,21.73 16.24,22.29 16.06,22.46 14.88,22.46 14.73,22.31 14.73,21.47 14.15,20.89 10.34,20.89 9.86,21.38 U4.2
N$15
  Bottom 0.152: PM.K 29.26,10.85 28.25,10.85 27.61,10.21 27.61,7.88 28.98,6.5 28.98,5.95 arc-45 28.8,5.5 arc-45 17.69,0.91 arc-45 5.94,5.77 4.87,6.85 4.87,15.66 5.31,16.1 U5.12
N$16
  Bottom 0.152: U5.10 6.61,15.8 5.68,14.88 5.68,10.54 6.76,9.46 6.76,6.04 7.72,5.08 DOWN.K
N$17
  Bottom 0.152: U5.11 5.96,15.8 5.38,15.22 5.38,9.53 LEFT.K
N$18
  Bottom 0.152: RIGHT.K 13.74,9.21 12.51,9.21 11.68,10.04 10.9,10.04 10.36,9.5 9.48,9.5 8.9,10.08 8.9,12.28 8.76,12.43 6.56,12.43 5.98,13 5.98,14.5 7.26,15.78 U5.9
N$19  (via drill 0.3)
  Top 0.152: v6.59,18.4 6.59,20.9 arc-90 v7.22,21.53
  Bottom 0.152: UP.K 9.03,13.12 8.48,13.66 8.48,15.59 8.31,15.76 7.87,15.76 7.65,15.99 7.65,18.24 7.49,18.4 v6.59,18.4 | v7.22,21.53 7.22,22.76 arc-90 U5.8
N$20  (via drill 0.3)
  Top 0.152: LD10.C 26.84,20.64 arc90 25.78,21.7 v22.12,21.7
  Bottom 0.152: v22.12,21.7 v22.11,21.69 21.02,21.69 20.46,22.25 U3.6
N$21  (via drill 0.3)
  Top 0.152: LD9.C 24.16,19.82 arc90 23.02,20.96 v21.38,20.96
  Bottom 0.152: v21.38,20.96 21.05,20.96 19.81,22.2 U3.5
N$22  (via drill 0.3)
  Top 0.152: LD8.C 21.49,19.73 arc-90 22.25,20.49 v22.61,20.49
  Bottom 0.152: v22.61,20.49 21.76,19.64 U3.9
N$23  (via drill 0.3)
  Top 0.152: v19.45,21.01 19.45,20.95 arc90 18.84,20.34 18.84,19.52 arc-90 LD7.C
  Bottom 0.152: U3.10 21.11,19.36 arc90 v19.45,21.01
N$24  (via drill 0.3)
  Top 0.152: v18.3,20.61 17.26,20.61 arc90 LD6.C
  Bottom 0.152: U3.11 20.46,18.73 arc90 18.58,20.61 v18.3,20.61
N$25  (via drill 0.3)
  Top 0.152: LD5.C arc-90 13.5,19.47 arc90 13.47,19.44 13.47,18.59 arc90 13.58,18.48 17.04,18.48 arc90 17.43,18.87 v17.43,19.92
  Bottom 0.152: U3.12 19.81,18.61 arc90 18.5,19.93 v17.44,19.93 v17.43,19.92
N$26
  Bottom 0.305: C9.2 20.84,14.7 20.52,14.37 20.52,12.67 20.24,12.39 U1.29
N$27  (via drill 0.3)
  Top 0.152: v11.98,19.92 11.77,19.92 arc90 11.35,19.5 LD4.C
  Bottom 0.152: v11.98,19.92 11.98,19.89 13.75,18.12 13.75,17.21 U4.9
N$28  (via drill 0.3)
  Top 0.152: LD3.C 8.13,20.43 arc-90 v8.5,20.81
  Bottom 0.152: v8.5,20.81 9.19,20.12 11.11,20.12 13.11,18.12 U4.10
N$29  (via drill 0.3)
  Top 0.152: v5.9,20.73 arc90 5.46,20.29 LD2.C
  Bottom 0.152: U4.11 12.46,17.21 arc90 9.89,19.78 6.85,19.78 arc-90 v5.9,20.73
N$30  (via drill 0.3)
  Top 0.152: v2.78,20.7 LD1.C
  Bottom 0.152: U4.12 11.81,17.32 arc90 9.63,19.49 3.99,19.49 arc-90 v2.78,20.7
N$31
  Bottom 0.152: U4.8 13.76,23.73 14.27,24.25 16.18,24.25 17.24,25.31 19.27,25.31 HOURS.K
N$32  (via drill 0.35)
  Top 0.152: MINUTES.K arc90 27.16,26.84 24.47,26.84 arc90 v24.02,26.39
  Bottom 0.152: U4.7 13.11,23.74 13.92,24.55 16.02,24.55 17.07,25.6 18.24,25.6 19.12,26.48 19.83,26.48 20.37,25.94 21.12,25.94 21.61,26.43 23.99,26.43 v24.02,26.39
N$33
  Bottom 0.152: U4.6 12.46,23.64 14.32,25.5 PLUS.K
N$34
  Bottom 0.152: U4.5 11.81,23.68 12.04,23.91 12.04,26.75 11.73,27.06 9.88,27.06 9.25,26.43 7.35,26.43 6.46,25.55 MINUS.K
SCL  (via drill 0.3)
  Top 0.152: v9.04,31.38 arc-90 10.17,30.25 10.17,30.18 arc-90 9.5,29.51 7.68,29.51 arc90 5.52,27.35 5.52,24.43 arc-90 3.14,22.05 arc90 1.74,20.66 1.74,15.87 arc90 2.15,15.46 11.49,15.46 arc-90 12.96,13.99 arc19 v13.2,12.54
  Bottom 0.152: R5.2 6.98,30.1 8.26,31.38 v9.04,31.38 U2.8 | U1.12 13.35,12.39 arc-90 v13.2,12.54
SDA  (via drill 0.3)
  Top 0.152: v9.09,30.11 8.01,30.11 arc90 5.21,27.31 5.21,24.44 arc-90 3.19,22.41 3.2,22.41 arc90 1.39,20.6 1.39,16.16 arc19 1.55,15.2 arc58 3.31,13.62 arc28 5.84,13.67 arc-23 10.71,13.98 arc-90 11.59,13.1 arc90 12.65,12.04 v12.76,12.04
  Bottom 0.152: R6.2 8.48,29.5 v9.09,30.11 U2.7 | U1.11 12.91,11.89 v12.76,12.04
SWCLK
  Bottom 0.152: U1.31 19.63,11.39 19.89,11.13 19.89,9.54 18.98,8.63 17.06,8.63 16.47,8.04 16.47,7.48 17,6.95 17,5.63 16.44,5.07 13.85,5.07 13.62,5.3 SWD.P$4
SWDIO
  Bottom 0.152: U1.32 19.08,9.28 18.72,8.92 16.95,8.92 16.3,8.27 16.16,8.13 SWD.P$2
VBUS_DTCT  (via drill 0.3)
  Top 0.152: v15.73,8.78 arc89 16.42,9.29 arc20 16.37,11.83 arc-11 16.19,13.66 arc-90 16.85,14.32 19.63,14.32 arc68 19.98,14.79 arc-48 20.01,14.85 arc-2 20.12,14.93 arc9 20.22,14.94 24.98,14.91 26.04,14.83 arc-26 27.38,14.27 arc38 28.45,13.93 arc-2 31.26,13.97 arc90 33.3,16.01 33.3,17.37 arc90 32.42,18.25 31.69,18.25 arc-90 30.81,19.13 30.81,19.73 arc43 30.31,21.53 arc65 28.98,22.04 arc-45 27.77,22.27 arc33 24.53,23.27 v24.53,23.28
  Bottom 0.152: R13.2 23.58,22.99 23.57,22.98 R12.1 arc-90 23.68,22.48 24.48,23.28 v24.53,23.28 | U1.5 16.39,9.21 15.96,8.78 v15.73,8.78
VBUS_FUSED
  Bottom 0.305: U7.4 22.68,29.2 23.09,28.78 23.58,28.78 23.95,28.41 23.95,27.63 24.24,27.34 C1.1 25.55,27.34 26.97,25.92 26.97,25.07 26.38,24.49 25.91,24.49 25.31,23.88 25.31,21.71 24.75,21.16 23.79,21.16 R12.2 23.57,19.46 F1.3 22.95,19.4 22.48,18.93 22.48,16.79 22.67,16.6 24.19,16.6 24.53,16.26 24.53,14.04 24.72,13.85 Q1.1 24.72,11.76 25.15,11.33 D1.A 24.48,10.5 23.87,9.89 R4.2
VDD  (via drill 0.3)
  Top 0.305: v16.92,7.75 16.84,7.75 16.82,7.73 13.22,7.73 arc-90 12.72,8.23 12.72,10.74 arc90 v12.56,10.9 v12.55,10.89 11.48,10.88 arc-47 10.6,11.25 arc35 9.74,11.72 arc14 5.04,12.09 arc-65 1.19,14.32 arc-24 0.88,15.44 arc-12 1.13,21.55 arc-66 2.21,22.78 arc-16 2.9,22.88 arc53 4.69,23.77 arc33 4.75,23.93 arc6 4.8,26.88 arc-42 5.72,29.6 arc-20 9.26,32.62 arc-62 v11.44,32.61
  Bottom 0.305: C8.1 14.38,32.9 | 14.38,32.9 11.73,32.9 v11.44,32.61 | U1.9 14.19,10.87 12.59,10.87 v12.56,10.9 11.72,10.9 C10.2 | C4.1 22.2,4.43 20.55,6.08 20.55,7.96 | 20.55,7.96 20.65,7.86 20.65,11.33 | 20.55,7.96 20.47,8.04 U6.5 18.86,8.04 18.69,8.21 17.72,8.21 17.26,7.75 v16.92,7.75 16.99,7.75 17.51,7.22 17.51,4.19 17.08,3.76 SWD.P$1 | U1.30 20.09,11.89 20.65,11.33 | 20.65,11.33 20.65,11.42 C11.2 | U2.2 14.58,30.11 14.18,30.5 14.18,31.9 14.38,32.1 14.38,32.9
VDDLEDS  (via drill 0.3, 0.35)
  Top 0.305: PLUS.A arc-90 14.97,27.5 | 14.97,27.5 10.32,27.5 arc90 9,26.18 MINUS.A | UP.A 9.58,10.33 9.58,7.87 DOWN.A | RIGHT.A 11.23,9.19 8.44,9.19 LEFT.A | LD3.A LD2.A LD1.A 2.78,18.23 v2.63,18.38 | LD3.A LD4.A LD5.A 13.47,15.83 arc90 v13.88,15.42 | LD10.A LD11.A | LD11.A LD12.A 32.18,16.07 arc-90 v31.37,15.26 | LD11.A arc90 29.53,16.52 29.53,17.56 arc90 28.77,18.32 25,18.32 arc90 24.17,17.49 LD9.A arc-90 LD9.A LD8.A 21.45,16.54 18.86,16.54 LD7.A 18.78,16.53 v17.5,16.53 16.18,16.53 LD6.A | LD3.A 8.01,16.61 8.01,18.17 v8.17,18.33 | 14.97,27.5 21.21,27.5 arc-90 21.99,26.72 HOURS.A MINUTES.A 26.48,25.5 arc-58 27.09,25.16 arc7 27.62,24.41 arc41 29.24,23.46 arc-31 v30.42,22.9
  Bottom 0.305: DOWN.A LEFT.A | v17.5,16.53 arc-90 17.5,16.62 17.21,16.91 U3.16 16.92,17.41 C5.2 14.72,17.41 arc90 14.22,16.91 14.22,15.78 13.88,15.44 arc-90 v13.88,15.42 | UP.A 9.83,11.64 10.85,12.66 10.85,13.53 9.33,15.05 C7.2 9.31,15.27 8.01,16.57 8.01,18.17 v8.17,18.33 8.19,18.35 9.05,18.35 9.21,18.2 U4.16 | C6.2 2.71,15.6 U5.16 2.71,18.3 v2.63,18.38 | v30.42,22.9 31.37,21.95 v31.37,15.26 29.62,13.5 27.28,13.5 26.73,12.95 PM.A SJ1.2
VSEL
  Bottom 0.305: U6.1 22.58,8.04 23.48,7.15 C3.1 25.64,7.15 26.7,8.2 SJ1.1 | U6.3 21.49,6.14 21.03,6.6 21.03,7.55 21.52,8.04 U6.1 | U6.1 21.85,8.18 D1.C 21.85,10.7 22.82,11.68 Q1.2

### Text on the board
bPlace: + | + | + | + | + | + | + | + | +